# EAGLE design mcu_v06 (EAGLE 6.2)
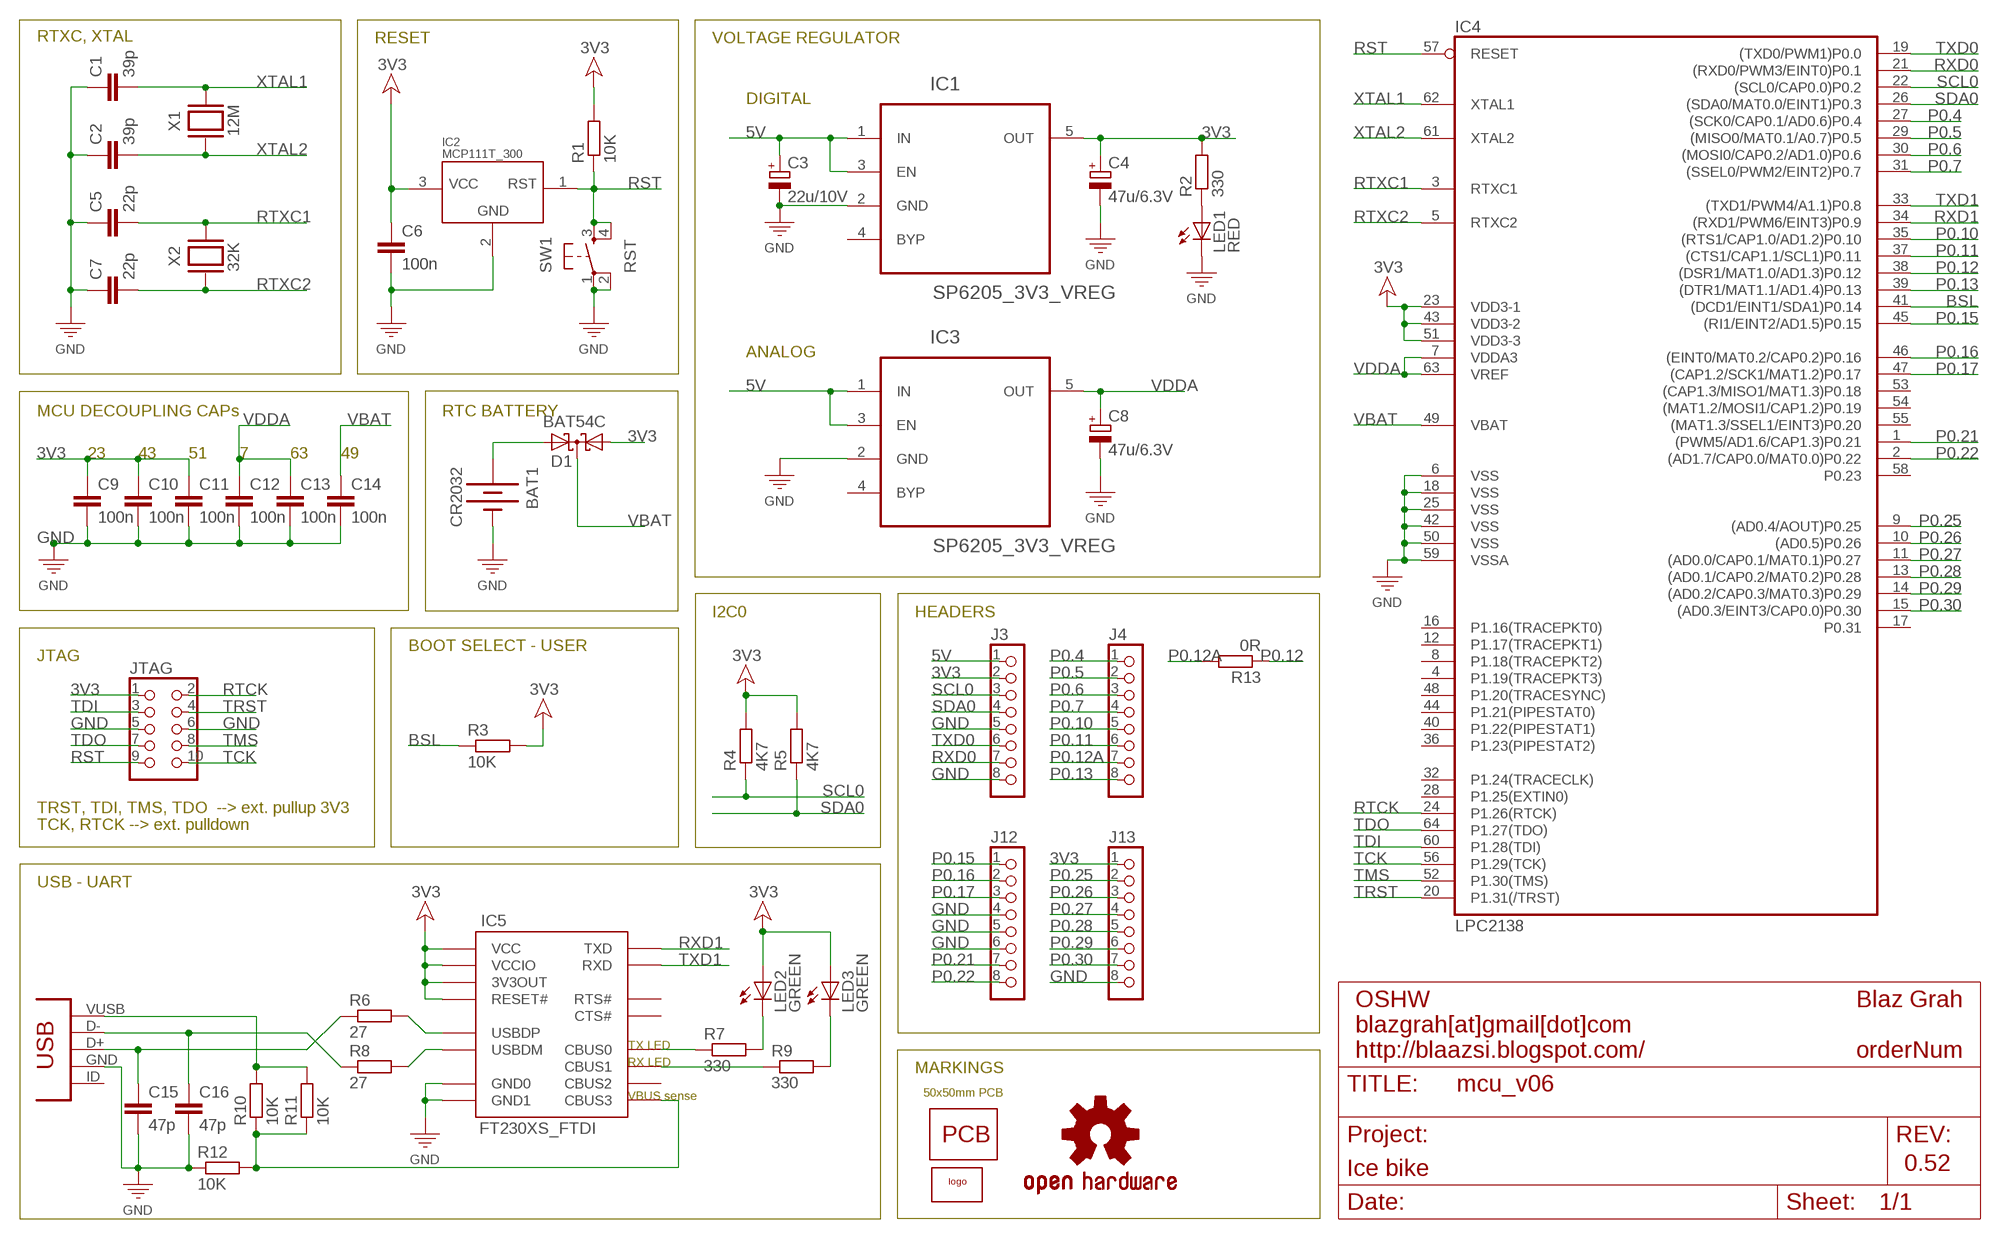
[diagram p0: schematic, sheet 1]

## Parts
BAT1  CR2032  BATTERY20MM  [BATTERY_20MM_SMD]
C1  39p  C-EUC0603  [C0603]
C2  39p  C-EUC0603  [C0603]
C3  22u/10V  CAPACITOR_POL-SMC_B  [SMC_B]
C4  47u/6.3V  CAPACITOR_POL-SMC_B  [SMC_B]
C5  22p  C-EUC0603  [C0603]
C6  100n  C-EUC0603  [C0603]
C7  22p  C-EUC0603  [C0603]
C8  47u/6.3V  CAPACITOR_POL-SMC_B  [SMC_B]
C9  100n  C-EUC0603  [C0603]
C10  100n  C-EUC0603  [C0603]
C11  100n  C-EUC0603  [C0603]
C12  100n  C-EUC0603  [C0603]
C13  100n  C-EUC0603  [C0603]
C14  100n  C-EUC0603  [C0603]
C15  47p  C-EUC0603  [C0603]
C16  47p  C-EUC0603  [C0603]
D1  BAT54C  [SOT23]
DOC  FRAME_DINA4_L  [DP_LOGO]
IC1  SP6205_3V3_VREG  [SOT23-5]
IC2  MCP111T_300  [SOT23]
IC3  SP6205_3V3_VREG  [SOT23-5]
IC4  LPC2138  LCP2138_LQFP64  [LQFP64]
IC5  FT230XS_FTDI  [SSOP16]
J3  CON_HEADER_1X08-PTH  [M1X8]
J4  CON_HEADER_1X08-PTH  [M1X8]
J12  CON_HEADER_1X08-PTH  [M1X8]
J13  CON_HEADER_1X08-PTH  [M1X8]
JTAG  CON_HEADER_2X05-PTH+SHROUDED_A  [PINSHRD_PTH_2X05]
LED1  RED  LED0805  [LED0805]
LED2  GREEN  LED0805  [LED0805]
LED3  GREEN  LED0805  [LED0805]
LOGO1  OSHW-LOGOS  [OSHW-LOGO-S]
PCB1  PCB  [PCB_50X50]
R1  10K  R-EU0603  [R0603]
R2  330  R-EU0603  [R0603]
R3  10K  R-EU0603  [R0603]
R4  4K7  R-EU0603  [R0603]
R5  4K7  R-EU0603  [R0603]
R6  27  R-EU0603  [R0603]
R7  330  R-EU0603  [R0603]
R8  27  R-EU0603  [R0603]
R9  330  R-EU0603  [R0603]
R10  10K  R-EU0603  [R0603]
R11  10K  R-EU0603  [R0603]
R12  10K  R-EU0603  [R0603]
R13  0R  R-EU0603J  [R0603_JUMP]
SW1  RST  TACTIL_BUTTON  [BUTTON_SW_4P_SMD]
U$13  LOGO  [LOGO_SMILE]
USB1  CON-USB-F-MINI-B  [CONN_USB_MINI-B]
X1  12M  CRYSTALSMD_4.8X10.6  [CRYSTAL_12M_4.8X10.6MM]
X2  32K  CRYSTALSMD_32K  [CRYSTAL_32K_SMD]

## Nets
3V3 [power]: C4.+ C6.1 C9.1 C10.1 C11.1 D1.1(A1) IC1.5(OUT) IC2.3(VCC) IC4.23(VDD3-1) IC4.43(VDD3-2) IC4.51(VDD3-3) IC5.P$3(VCCIO) IC5.P$10(3V3OUT) IC5.P$11(RESET#) IC5.P$12(VCC) J3.2 J13.1 JTAG.1 LED2.A LED3.A R1.2 R2.2 R3.2 R4.2 R5.2
5V [supply]: C3.+ IC1.1(IN) IC1.3(EN) IC3.1(IN) IC3.3(EN) J3.1
BSL: IC4.41((DCD1/EINT1/SDA1)P0.14) R3.1
GND [power]: BAT1.NEG C1.1 C2.1 C3.- C4.- C5.1 C6.2 C7.1 C8.- C9.2 C10.2 C11.2 C12.2 C13.2 C14.2 C15.2 C16.2 IC1.2(GND) IC2.2(GND) IC3.2(GND) IC4.6(VSS) IC4.18(VSS) IC4.25(VSS) IC4.42(VSS) IC4.50(VSS) IC4.59(VSSA) IC5.P$5(GND0) IC5.P$13(GND1) J3.5 J3.8 J12.4 J12.5 J12.6 J13.8 JTAG.5 JTAG.6 LED1.C R12.1 SW1.1 SW1.2 USB1.GND
N$4: LED1.A R2.1
N$5: BAT1.POS1(POZ) BAT1.POS2(POZ) D1.2(A2)
N$6: C16.1 R8.1 USB1.D-
N$7: C15.1 R6.1 USB1.D+
N$8: IC5.P$9(USBDM) R8.2
N$9: IC5.P$8(USBDP) R6.2
N$10: R10.2 R11.2 USB1.VUSB
N$11: IC5.P$16(CBUS3) R10.1 R11.1 R12.2
N$12: IC5.P$14(CBUS1) R9.1
N$13: LED2.C R7.2
N$14: LED3.C R9.2
N$15: IC5.P$15(CBUS0) R7.1
P0.4: IC4.27((SCK0/CAP0.1/AD0.6)P0.4) J4.1
P0.5: IC4.29((MISO0/MAT0.1/A0.7)P0.5) J4.2
P0.6: IC4.30((MOSI0/CAP0.2/AD1.0)P0.6) J4.3
P0.7: IC4.31((SSEL0/PWM2/EINT2)P0.7) J4.4
P0.10: IC4.35((RTS1/CAP1.0/AD1.2)P0.10) J4.5
P0.11: IC4.37((CTS1/CAP1.1/SCL1)P0.11) J4.6
P0.12: IC4.38((DSR1/MAT1.0/AD1.3)P0.12) R13.1
P0.12A: J4.7 R13.2
P0.13: IC4.39((DTR1/MAT1.1/AD1.4)P0.13) J4.8
P0.15: IC4.45((RI1/EINT2/AD1.5)P0.15) J12.1
P0.16: IC4.46((EINT0/MAT0.2/CAP0.2)P0.16) J12.2
P0.17: IC4.47((CAP1.2/SCK1/MAT1.2)P0.17) J12.3
P0.21: IC4.1((PWM5/AD1.6/CAP1.3)P0.21) J12.7
P0.22: IC4.2((AD1.7/CAP0.0/MAT0.0)P0.22) J12.8
P0.25: IC4.9((AD0.4/AOUT)P0.25) J13.2
P0.26: IC4.10((AD0.5)P0.26) J13.3
P0.27: IC4.11((AD0.0/CAP0.1/MAT0.1)P0.27) J13.4
P0.28: IC4.13((AD0.1/CAP0.2/MAT0.2)P0.28) J13.5
P0.29: IC4.14((AD0.2/CAP0.3/MAT0.3)P0.29) J13.6
P0.30: IC4.15((AD0.3/EINT3/CAP0.0)P0.30) J13.7
RST: IC2.1(RST) IC4.57(RESET) JTAG.9 R1.1 SW1.3 SW1.4
RTCK: IC4.24(P1.26(RTCK)) JTAG.2
RTXC1: C5.2 IC4.3(RTXC1) X2.X2
RTXC2: C7.2 IC4.5(RTXC2) X2.X1
RXD0: IC4.21((RXD0/PWM3/EINT0)P0.1) J3.7
RXD1: IC4.34((RXD1/PWM6/EINT3)P0.9) IC5.P$1(TXD)
SCL0: IC4.22((SCL0/CAP0.0)P0.2) J3.3 R4.1
SDA0: IC4.26((SDA0/MAT0.0/EINT1)P0.3) J3.4 R5.1
TCK: IC4.56(P1.29(TCK)) JTAG.10
TDI: IC4.60(P1.28(TDI)) JTAG.3
TDO: IC4.64(P1.27(TDO)) JTAG.7
TMS: IC4.52(P1.30(TMS)) JTAG.8
TRST: IC4.20(P1.31(/TRST)) JTAG.4
TXD0: IC4.19((TXD0/PWM1)P0.0) J3.6
TXD1: IC4.33((TXD1/PWM4/A1.1)P0.8) IC5.P$4(RXD)
VBAT: C14.1 D1.3(CC) IC4.49(VBAT)
VDDA [power]: C8.+ C12.1 C13.1 IC3.5(OUT) IC4.7(VDDA3) IC4.63(VREF)
XTAL1: C1.2 IC4.62(XTAL1) X1.P$2
XTAL2: C2.2 IC4.61(XTAL2) X1.P$1
Unconnected: IC1.4(BYP) IC3.4(BYP) IC4.4(P1.19(TRACEPKT3)) IC4.8(P1.18(TRACEPKT2)) IC4.12(P1.17(TRACEPKT1)) IC4.16(P1.16(TRACEPKT0)) IC4.17(P0.31) IC4.28(P1.25(EXTIN0)) IC4.32(P1.24(TRACECLK)) IC4.36(P1.23(PIPESTAT2)) IC4.40(P1.22(PIPESTAT1)) IC4.44(P1.21(PIPESTAT0)) IC4.48(P1.20(TRACESYNC)) IC4.53((CAP1.3/MISO1/MAT1.3)P0.18) IC4.54((MAT1.2/MOSI1/CAP1.2)P0.19) IC4.55((MAT1.3/SSEL1/EINT3)P0.20) IC4.58(P0.23) IC5.P$2(RTS#) IC5.P$6(CTS#) IC5.P$7(CBUS2) USB1.BODY@1(BODY) USB1.BODY@2(BODY) USB1.BODY@3(BODY) USB1.BODY@4(BODY) USB1.ID(USBID)

## Notes on the sheet
- RTXC, XTAL | RESET | VOLTAGE REGULATOR
- DIGITAL
- ANALOG
- MCU DECOUPLING CAPs | RTC BATTERY
- 23 | 43 | 51 | 7 | 63 | 49
- I2C0 | HEADERS
- BOOT SELECT - USER
- JTAG
- TRST, TDI, TMS, TDO  --> ext. pullup 3V3
- TCK, RTCK --> ext. pulldown
- USB - UART
- TX LED
- RX LED
- MARKINGS
- VBUS sense | 50x50mm PCB

## Library data of the parts
BAT1 = 00_beegee:BATTERY: BATTERY CONNECTORS
C1 C2 C5-C7 C9-C16 = 00_beegee:C-EU: CAPACITOR 22p ... 0603..... Farnell <http://si.farnell.com/multicomp/mcca000196/mlcc-0603-np0-50v-22pf/dp/1759057RL> ... 0.60€/100kom (dec. 2011) 100n .. 0603..... Farnell <http://si.farnell.com/multicomp/mcca000255/mlcc-0603-x7r-50v-100nf/dp/1759122> ... 0.60€/100kom (dec. 2011)
C3 C4 C8 = 10_dang_prototyps:CAPACITOR_POL: Polarized capacitor in various packages
D1 = diode:BAT54C: Schottky Diodes Source: Fairchild .. BAT54.pdf
DOC = 10_dang_prototyps:FRAME_DINA4_L: A4 DP frame Standard Dangerous Prototypes schematic frame. Automagically adds the DP logo and standard texts to the PCB Use the atrribute in the schematic editor to change the fields.; AUTHOR: Blaz Grah; DATE: 23.4.2012; LICENSE: OSHW; ORDER_NUM: orderNum; PROJECT: Ice bike; REV: 0.52; URL1: blazgrah[at]gmail[dot]com; URL2: http://blaazsi.blogspot.com/
IC1 IC3 = 01_farnell:SP6205_3V3_VREG; OC_FARNELL: 9388338; PACKAGE: SOT-23-5
IC2 = 00_beegee:MCP111T_300: Voltage supervissor Farnell: http://si.farnell.com/microchip/mcp111t-300e-tt/suppervisor-1ua-2-93v-sot-23b/dp/1605552RL 0,38€/1
IC4 = 00_beegee:LCP2138: NXP - LPC2138FBD64 32bit ARM7, 512k FLASH, LQFP64 ... Farnell <http://si.farnell.com/nxp/lpc2138fbd64/16-32bit-mcu-arm7-512k-flash-64lqfp/dp/1727704> ... 27.18€ (dec.2011)
IC5 = 01_farnell:FT230XS_FTDI: USB to UART http://si.farnell.com/ftdi/ft230xs/i-f-usb2-0-fs-to-basic-uart-16ssop/dp/2081321?Ntt=ft230xs 1.56€/1
J3 J4 J12 J13 = 10_dang_prototyps:CON_HEADER_1X08
JTAG = 10_dang_prototyps:CON_HEADER_2X05: 2x05 pin header
LED1-LED3 = 11_SparkFun:LED: LEDs Standard schematic elements and footprints for 5mm, 3mm, 1206, and 0603 sized LEDs. 5mm - Spark Fun Electronics SKU : COM-00529 (and others)
LOGO1 = 11_SparkFun:OSHW-LOGO: Open Source Hardware Logo This logo indicates the piece of hardware it is found on incorporates a OSHW license and/or adheres to the definition of open source hardware found here: http://freedomdefined.org/OSHW
PCB1 = 00_beegee:PCB: PCB size template
R1-R13 = 00_beegee:R-EU: RESISTOR Resistors: 10k ... 0603 ... Farnell <http://si.farnell.com/panasonic/erj3geyj103v/resistor-0603-10k-5-0-1w/dp/2059627> ... 0.40€/50kom (dec.2011)
SW1 = 00_beegee:TACTIL_BUTTON
U$13 = 00_beegee:LOGO
USB1 = 10_dang_prototyps:CON-USB-F: USB Female connector
X1 X2 = 00_beegee:CRYSTAL: CRYSTAL

## Net classes
0 default: width 0.254 mm, clearance 0.178 mm
1 power: width 0.254 mm, clearance 0.178 mm to class 0, clearance 0.178 mm
2 supply: width 0.381 mm, clearance 0.254 mm to class 0, clearance 0.254 mm to class 1, clearance 0.254 mm

## Board
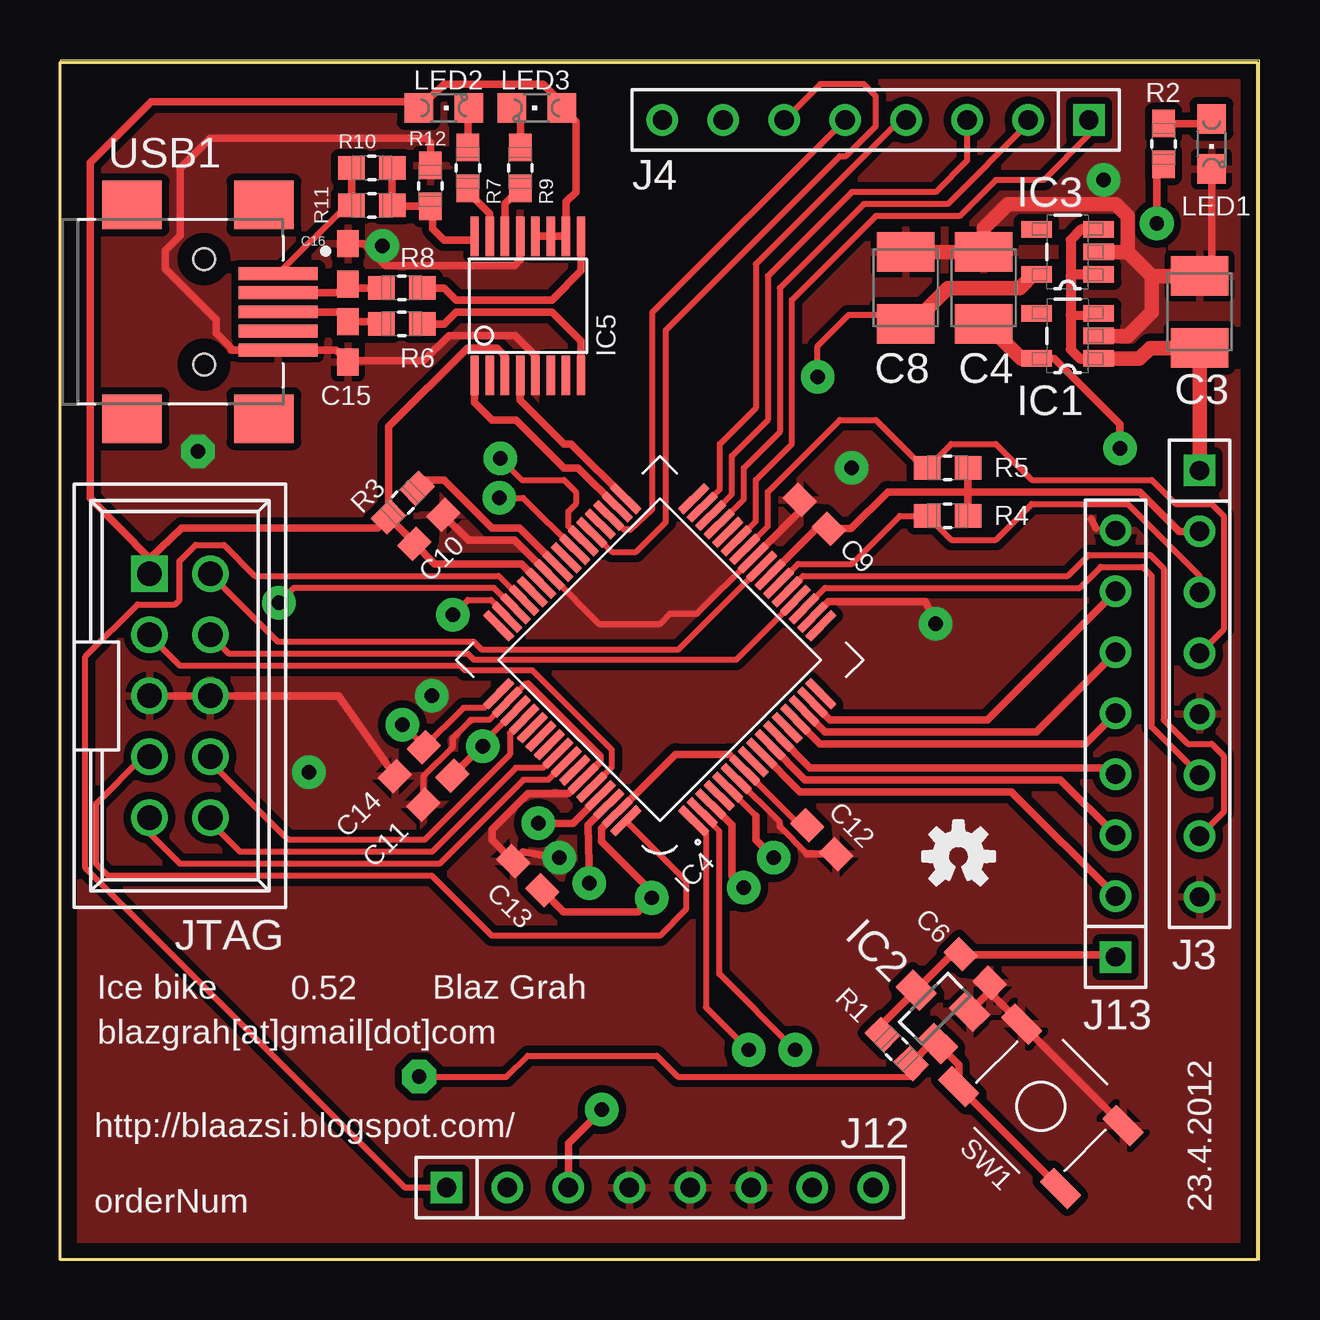
[diagram p1: board, top side]
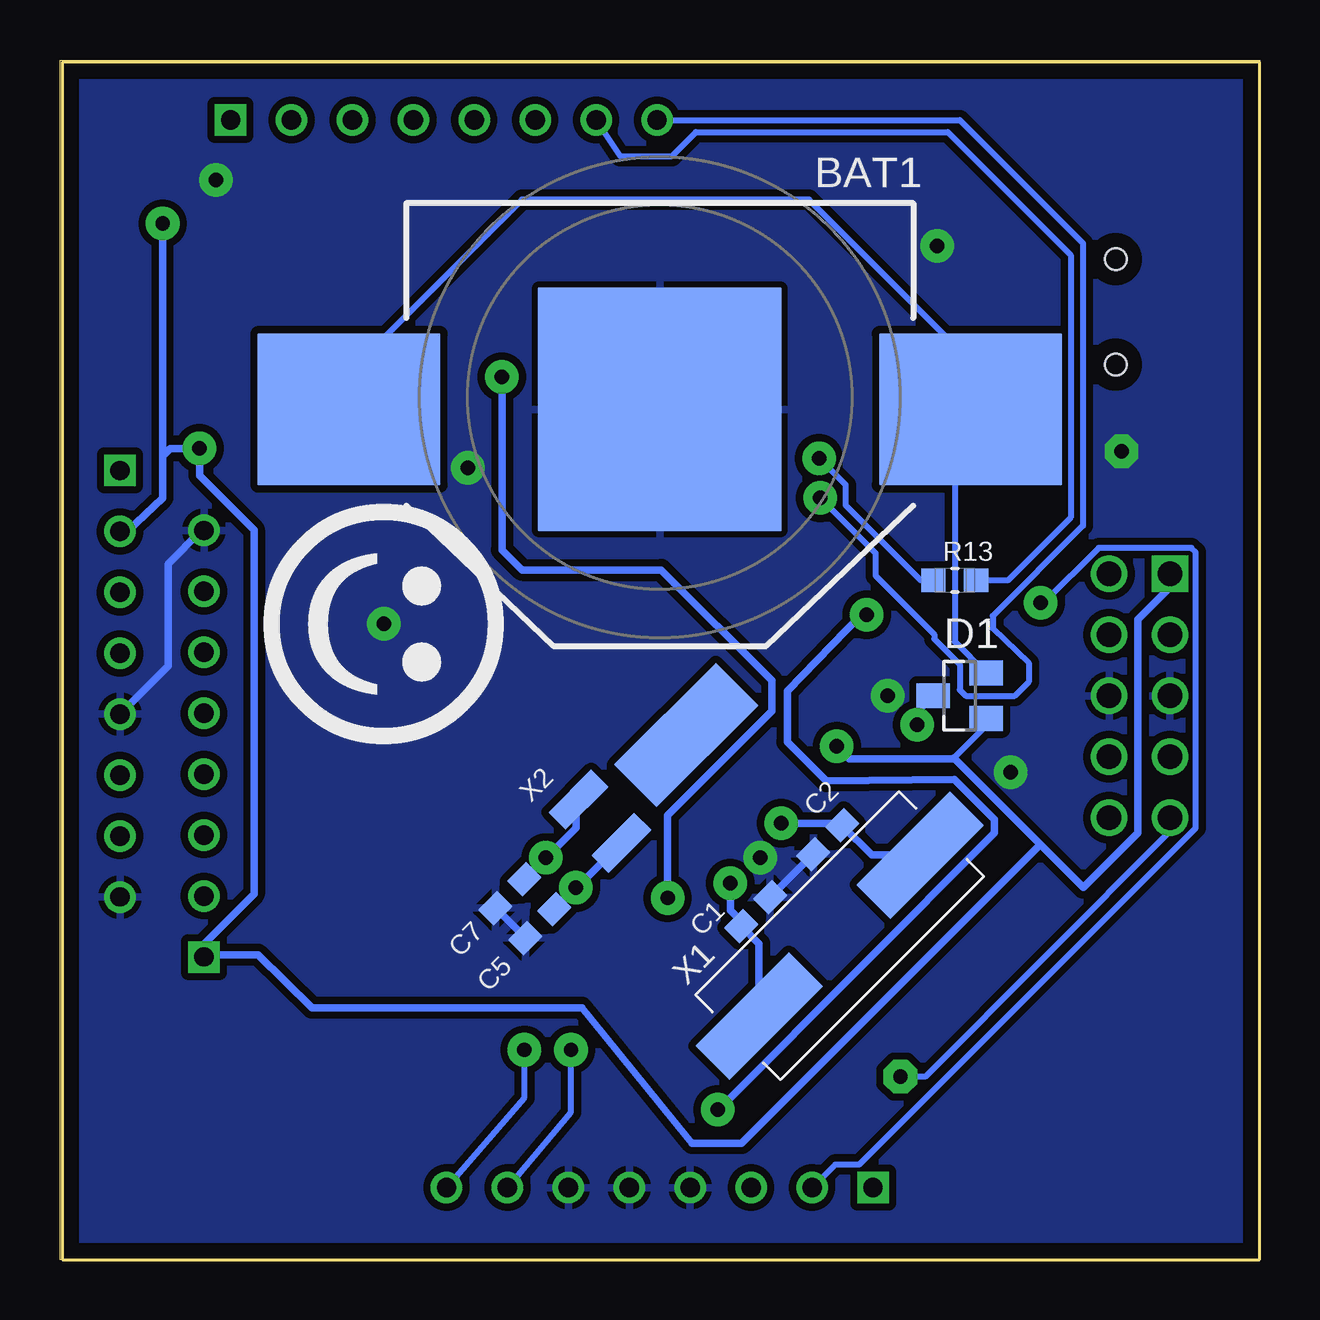
[diagram p2: board, bottom side, seen from below]

Size 50 x 50 mm. Coordinates in mm from the lower left corner, seen from the top.
Outline: 0,0 50,0 50,50 0,50 0,0
Copper layers (1*16): Top 0.035mm / dielectric 1.5mm / Bottom 0.035mm
Design rules: minimum track width 6mil, minimum drill 12mil, track to track 6mil, track to pad 6mil, pad to pad 6mil, via to via 6mil, smd to smd 0mil, copper to edge 25mil, drill to drill 25mil, minimum pad ring 10mil, minimum via ring 6mil, stop-mask expansion 2mil, vias tented up to drill 100mil, thermal gap 10mil

### Footprints (pad centres in the part's own frame; a part is rotated, then mirrored left to right if it is on the bottom)
BATTERY_20MM_SMD = smd 10.16 x 10.16: NEG 0,0 | smd 7.62 x 6.35: POS1 -12.954,0; POS2 12.954,0
C0603 = smd 1.1 x 0.9: 1 -0.85,0; 2 0.85,0
SMC_B = smd 1.6 x 2.4: + -1.5,0; - 1.5,0
SOT23 = smd 1 x 1.4: 1 -0.95,-1.1; 2 0.95,-1.1; 3 0,1.1
SOT23-5 = smd 1.27 x 0.66: 1 -1.295,0.94; 2 -1.295,0; 3 -1.295,-0.94; 4 1.295,-0.94; 5 1.295,0.94
LQFP64 = smd 0.3 x 1.5: 1 -3.75,-5.75; 2 -3.25,-5.75; 3 -2.75,-5.75; 4 -2.25,-5.75; 5 -1.75,-5.75; 6 -1.25,-5.75; 7 -0.75,-5.75; 8 -0.25,-5.75; 9 0.25,-5.75; 10 0.75,-5.75; 11 1.25,-5.75; 12 1.75,-5.75; 13 2.25,-5.75; 14 2.75,-5.75; 15 3.25,-5.75; 16 3.75,-5.75; 33 3.75,5.75; 34 3.25,5.75; 35 2.75,5.75; 36 2.25,5.75; 37 1.75,5.75; 38 1.25,5.75; 39 0.75,5.75; 40 0.25,5.75; 41 -0.25,5.75; 42 -0.75,5.75; 43 -1.25,5.75; 44 -1.75,5.75; 45 -2.25,5.75; 46 -2.75,5.75; 47 -3.25,5.75; 48 -3.75,5.75 | smd 1.5 x 0.3: 17 5.75,-3.75; 18 5.75,-3.25; 19 5.75,-2.75; 20 5.75,-2.25; 21 5.75,-1.75; 22 5.75,-1.25; 23 5.75,-0.75; 24 5.75,-0.25; 25 5.75,0.25; 26 5.75,0.75; 27 5.75,1.25; 28 5.75,1.75; 29 5.75,2.25; 30 5.75,2.75; 31 5.75,3.25; 32 5.75,3.75; 49 -5.75,3.75; 50 -5.75,3.25; 51 -5.75,2.75; 52 -5.75,2.25; 53 -5.75,1.75; 54 -5.75,1.25; 55 -5.75,0.75; 56 -5.75,0.25; 57 -5.75,-0.25; 58 -5.75,-0.75; 59 -5.75,-1.25; 60 -5.75,-1.75; 61 -5.75,-2.25; 62 -5.75,-2.75; 63 -5.75,-3.25; 64 -5.75,-3.75
SSOP16 = smd 0.35 x 1.6: P$1 -2.223,-2.9; P$2 -1.587,-2.9; P$3 -0.953,-2.9; P$4 -0.318,-2.9; P$5 0.318,-2.9; P$6 0.953,-2.9; P$7 1.587,-2.9; P$8 2.223,-2.9; P$9 2.223,2.9; P$10 1.587,2.9; P$11 0.953,2.9; P$12 0.318,2.9; P$13 -0.318,2.9; P$14 -0.953,2.9; P$15 -1.587,2.9; P$16 -2.223,2.9
M1X8 = drill 0.8 square: 1 -8.89,0 | drill 0.8: 2 -6.35,0; 3 -3.81,0; 4 -1.27,0; 5 1.27,0; 6 3.81,0; 7 6.35,0; 8 8.89,0
PINSHRD_PTH_2X05 = drill 1.016 square: 1 -5.08,-1.27 | drill 1.016: 2 -5.08,1.27; 3 -2.54,-1.27; 4 -2.54,1.27; 5 0,-1.27; 6 0,1.27; 7 2.54,-1.27; 8 2.54,1.27; 9 5.08,-1.27; 10 5.08,1.27
LED0805 = smd 1.2 x 1.2: A 0,-1.05; C 0,1.05
R0603 = smd 1.118 x 0.94: 1 -0.85,0; 2 0.85,0
R0603_JUMP = smd 1.016 x 0.94: 1 -0.89,0; 2 0.89,0
BUTTON_SW_4P_SMD = smd 1.6 x 0.8: 1 -3,1.85; 2 3,1.85; 3 -3,-1.85; 4 3,-1.85
CONN_USB_MINI-B = smd 2 x 2.5: BODY@1 -4.45,2.5; BODY@2 4.45,2.5; BODY@3 4.45,-3; BODY@4 -4.45,-3 | smd 0.5 x 3.3: D+ 0,3.1; D- -0.8,3.1; GND 1.6,3.1; ID 0.8,3.1; VUSB -1.6,3.1 | hole 0.9: -2.2,0; 2.2,0
CRYSTAL_12M_4.8X10.6MM = smd 5.5 x 2: P$1 4.75,0; P$2 -4.75,0
CRYSTAL_32K_SMD = smd 2.5 x 6: SHEILD -0.01,5.1 | smd 1 x 2.5: X1 -1.28,0.02; X2 1.26,0.02

### Placement (x,y rotation side)
BAT1  25,35.44 0 bottom
C1  21,14.5 225 bottom
C2  18,17.5 45 bottom
C3  47.5,39.5 90 top
C4  38.5,40.5 90 top
C5  30,14 45 bottom
C6  38.15,12.13 315 top
C7  31.25,15.25 45 bottom
C8  35.25,40.5 90 top
C9  31.44,31.06 135 top
C10  15.38,30.44 45 top
C11  15.75,19.56 225 top
C12  31.75,17.5 315 top
C13  19.5,16 135 top
C14  14.56,20.75 225 top
C15  12,38.25 270 top
C16  12,41.5 90 top
D1  12.5,23.5 90 bottom
DOC  1.63,1.94 0 top
IC1  42,38.5 180 top
IC2  36.47,10.45 45 top
IC3  42,42 180 top
IC4  25,25 45 top
IC5  19.5,39.75 0 top
J3  47.5,24 270 top
J4  34,47.5 180 top
J12  25,3 0 top
J13  44,21.5 90 top
JTAG  5,23.5 270 top
LED1  48,46.5 180 top
LED2  16,48 270 top
LED3  19.88,48 90 top
LOGO1  37.45,16.8 0 top
PCB1  0,0 0 top
R1  34.88,8.78 135 top
R2  46,46.5 270 top
R3  14.29,31.55 225 top
R4  37,31 0 top
R5  37,33 0 top
R6  14.25,39 0 top
R7  17,45.5 90 top
R8  14.25,40.5 0 top
R9  19.19,45.5 90 top
R10  13,45.5 180 top
R11  13,43.94 180 top
R12  15.44,44.75 270 top
R13  12.7,28.31 0 bottom
SW1  40.89,6.39 315 top
U$13  36.5,26.5 90 top
USB1  6,39.5 270 top
X1  17.5,13.5 45 bottom
X2  27.5,18.25 315 bottom

### Tracks (layer width: path | path; a pad name or v marks a point on that pad's centre or on a via)
3V3  (via drill 0.6 pad 1.4)
  Top 0.254: IC4.51 17.62,21.51
  Top 0.305: R1.2 34.28,9.82 IC2.3 37.19,12.73 C6.1 38.1,12.7 44.45,12.7 J13.1 | IC4.23 31.52,30.46 C9.1 32.96,30.46 34.5,32 37.85,32 | IC5.P$12 IC5.P$11 IC5.P$10 21.09,44.09 21.5,44.5 21.5,47.42 LED3.A 20.93,48.2 20.12,49 16,49 15.45,48.45 14.95,48.45 LED2.A 15.24,48.26 3.81,48.26 1.27,45.72 1.27,31.75 3.75,29.21 | v45.72,43.18 45.72,45.72 R2.2 | 3.75,29.21 5.08,30.48 5.1,30.5 13.24,30.5 R3.2 | 3.75,29.21 JTAG.1 | IC5.P$3 18.54,37.68 18.22,38 16.98,38 13.69,34.71 R3.2 | v17.62,21.4 17.57,21.45 | 17.62,21.51 v17.62,21.4 | C11.1 17.59,21.4 v17.62,21.4 | 37.85,32 R4.2 | R5.2 37.85,32 | 37.85,32 45,32 46.65,30.35 J3.2 | IC1.5 41.44,37.56 44.18,34.82 v44.18,33.82 v44.19,33.81 | R3.2 14.77,29.87 C10.1 15.61,29 19.23,29 IC4.43
  Top 0.61: IC1.5 40.06,37.56 38.62,39 C4.+
  Bottom 0.254: D1.1 11.4,22.24 12.74,20.9 12.74,20.89 12.75,20.88
  Bottom 0.305: 45.72,33.5 45.72,31.75 47.18,30.36 J3.2 | 45.72,33.5 v45.72,43.18 | 44.45,12.7 41.91,15.24 41.91,30.41 44.19,32.69 v44.19,33.81 45.41,33.81 45.72,33.5 | 9.14,17.3 7.35,15.51 5.08,17.78 5.08,26.67 3.75,28 JTAG.1 | 44.45,12.7 41.75,12.7 39.5,10.5 28.25,10.5 23.65,4.85 21.59,4.85 9.14,17.3 | 44.45,12.7 J13.1 | 12.75,20.88 17.09,20.88 v17.62,21.4 | 9.14,17.3 12.74,20.9
5V
  Top 0.381: 42.12,39.37 43.18,39.37 IC1.3
  Top 0.406: 43.36,43 IC3.3 42.56,42.94 42.12,42.5 42.12,41 | 42.12,41 42.12,39.37 42.12,37.94 42.5,37.56 IC1.1 | IC3.1 42.19,41.06 42.12,41
  Top 0.61: IC1.1 45,37.56 45.44,38 C3.+ J3.1
BSL
  Top 0.305: R3.1 15.24,32.5 16,32.5 18,30.5 19.15,30.5 IC4.41
GND  (via drill 0.6 pad 1.4)
  Top 0.254: 31.15,16.9 30,18.05 30,18.23 IC4.6 | 28.78,29.14 26.56,26.92 25.42,26.92 25,26.5 22.46,26.5 20.5,28.46 IC4.42 | 19.5,24 19.4,24 IC4.50 17.9,22.5 17.12,22.5 16.38,21.75 16.38,21.38 15.15,20.15 C11.2
  Top 0.305: SW1.2 SW1.1 38.75,11.14 C6.2 38.75,11.18 IC2.2 | C16.2 12.65,42.35 13.56,41.44 18.94,41.44 19.18,41.68 | IC5.P$13 19.18,41.68 | 19.18,41.68 19.19,41.69 | 31.15,16.9 C12.2 | C14.2 11.61,23.5 JTAG.6 JTAG.5 | LED1.C 48,41.5 C3.- | R12.1 15.44,46.56 15.25,46.75 6.25,46.75 5,45.5 5,42.69 4.38,42.06 4.38,41.31 6.5,39.19 6.5,38.62 7.22,37.9 | 7.22,37.9 USB1.GND 11.5,37.9 C15.2 12.14,37.46 15.16,37.46 16.22,38.52 18.96,38.52 19.8,37.68 19.8,36.86 IC5.P$5 | 43.18,30.48 42.99,30.86 | C9.2 30.82,31.66 30.96,31.52 31.02,31.38 IC4.25 28.78,29.14 | 7.16,37.9 7.22,37.9 | IC4.18 32.03,27.44 36.06,27.44 v36.5,26.5 | 19.5,24 22.5,21 22.5,20.73 IC4.59 21.2,19.44 19.5,19.44 18,17.94 18,17.5 C13.2 19.3,17 v20.81,16.75 | C10.2 17,30.02 17,30 18.94,30 IC4.42 | 44.45,30.48 J13.8 44.45,30.48
  Top 0.61: C8.- C4.- 38.5,43 39.5,44 44,44 44.5,43.5 44.5,42 | 45.5,41 44.5,42 | 44.5,42 IC3.2 | C3.- 45.5,41 | 45.5,41 45.5,39.5 44.5,38.5 IC1.2
  Bottom 0.305: J13.8 44.11,30.39 45.5,29 45.5,24.73 J3.5 | C5.1 C7.1 | C2.1 C1.1 | 25.2,35.16 25.38,35.16 BAT1.NEG
  other vias: 5.75,33.69 13.44,42.25 10.38,20.31 43.5,45 33,33 15.5,23.5
  pour Bottom (isolate 0.305): 0,49.81 49.81,49.81 49.81,0 0,0
  pour Top (isolate 0.305): 0,49.81 49.81,49.81 49.81,0 0,0
N$4
  Top 0.305: LED1.A 47.8,47.35 R2.1
N$5
  Bottom 0.254: D1.2 12.7,25.75 12.7,36.89 BAT1.POS2 12.7,38.1 18.78,44.18 30.75,44.18 36.83,38.1 BAT1.POS1
N$6
  Top 0.305: USB1.D- 11.65,40.3 C16.1 12.15,40.5 R8.1
N$7
  Top 0.305: USB1.D+ 11.6,39.5 C15.1 13.3,39.1 R6.1
N$8
  Top 0.305: R8.2 16,40.5 16.5,40 20.5,40 21.72,41.22 IC5.P$9
N$9
  Top 0.305: R6.2 16,39 16.5,39.5 20.5,39.5 21.72,38.28 IC5.P$8
N$10
  Top 0.254: R11.2 11.94,43.94 USB1.VUSB
  Top 0.305: R11.2 R10.2
N$11
  Top 0.305: R10.1 R11.1 13.89,43.9 R12.2 15.54,44 15.54,42.96 16,42.5 17.13,42.5 IC5.P$16
N$12
  Top 0.305: IC5.P$14 18.55,44.01 R9.1
N$13
  Top 0.305: R7.2 17,47.95 LED2.C
N$14
  Top 0.254: 19.05,48.26 LED3.C
  Top 0.305: R9.2 19.19,47.64 LED3.C
N$15
  Top 0.305: IC5.P$15 17.91,43.59 17,44.5 R7.1
P0.4
  Top 0.254: J4.1 42.89,46.89 41,45 39,45 37.5,43.5 34,43.5 30.5,40 30.5,34 29,32.5 29,30.77 IC4.27
P0.5
  Top 0.254: J4.2 40.35,47.35 37,44 33.5,44 30,40.5 30,34.5 28.5,33 28.5,31.68 IC4.29
P0.6
  Top 0.254: J4.3 37.81,45.81 36.5,44.5 33,44.5 29.5,41 29.5,35 28,33.5 28,31.89 IC4.30
P0.7
  Top 0.254: J4.4 35,47.5 29,41.5 29,35.5 27.5,34 27.5,32.1 IC4.31
P0.10
  Top 0.254: IC4.35 22.94,31 23.52,30.42 23.78,30.42 24.68,31.26 24.68,39.47 J4.5
P0.11
  Top 0.254: IC4.37 22.22,30.3 23.02,29.5 24,29.5 25.25,30.75 25.25,38.75 32.5,46 32.75,46 34,47.25 34,48.5 33.5,49 31.69,49 J4.6
P0.12  (via drill 0.6 pad 1.4)
  Top 0.254: IC4.38 21.8,29.96 21.19,30.57 21.19,31.19 21.5,31.5 21.5,32 21,32.5 19.26,32.5 v18.36,33.4
  Bottom 0.254: R13.1 14.12,28.31 17.25,31.44 17.25,32.29 v18.36,33.4
P0.12A
  Bottom 0.254: J4.7 26.65,46 24.5,46 23.5,47 13,47 7.88,41.88 7.88,30.94 10.5,28.31 R13.2
P0.13  (via drill 0.6 pad 1.4)
  Top 0.254: 21.48,29.58 IC4.39 19.31,31.75 v18.31,31.75
  Bottom 0.254: J4.8 12.5,47.5 7.36,42.35 7.36,30.59 11.12,26.83 11.12,26.31 9.62,24.88 9.62,24.08 10.2,23.5 12.25,23.5 12.5,23.75 12.5,24.81 13.55,25.87 13.55,26.05 16,28.5 16,29.44 v18.31,31.75
P0.15
  Top 0.254: J12.1 14.38,3 1.06,16.32 1.06,25.13 3.24,27.31 4.8,27.31 4.99,27.49 4.99,29.12 5.65,29.79 6.83,29.79 8.12,28.5 18.28,28.5 19.3,27.48 IC4.45
P0.16  (via drill 0.6 pad 1.4)
  Top 0.254: IC4.46 18.98,27.14 18.94,27.14 18.07,28 9.75,28 v9.12,27.38
  Bottom 0.254: J12.2 17.68,3.96 16.68,3.96 2.66,17.98 2.66,29.48 2.84,29.66 6.7,29.66 8.98,27.38 v9.12,27.38
P0.17  (via drill 0.6 pad 1.4)
  Top 0.254: IC4.47 18.7,26.76 17.96,27.5 17,27.5 v16.38,26.88
  Top 0.305: J12.3 21.19,4.85 v22.59,6.25
  Bottom 0.305: v16.38,26.88 16.62,26.88 19.68,23.7 19.68,21.58 18.05,19.95 12.72,20.01 11.05,18.34 11.05,17.79 22.19,6.62 22.56,6.25 v22.59,6.25
P0.21  (via drill 0.6 pad 1.4)
  Top 0.254: v28.7,8.74 26.92,10.52 26.92,17.78 IC4.1
  Bottom 0.254: v28.7,8.74 28.7,6.14 J12.7
P0.22  (via drill 0.6 pad 1.4)
  Top 0.254: v30.64,8.74 27.48,11.9 27.48,17.86 26.78,18.56 26.78,18.62 IC4.2
  Bottom 0.254: v30.64,8.74 30.64,6.74 J12.8
P0.25
  Top 0.305: IC4.9 30.85,19.5 39.65,19.5 J13.2
P0.26
  Top 0.305: IC4.10 31.06,20 41.69,20 J13.3
P0.27
  Top 0.305: IC4.11 31.27,20.5 43.73,20.5 J13.4
P0.28
  Top 0.305: IC4.13 31.68,21.5 42.73,21.5 J13.5
P0.29
  Top 0.305: IC4.14 31.89,22 40.69,22 J13.6
P0.30
  Top 0.305: IC4.15 32.1,22.5 38.65,22.5 J13.7
RST  (via drill 0.6 pad 1.4)
  Top 0.254: IC4.57 20.35,20 19.31,20 15.81,16.5 5,16.5 3.73,17.77 JTAG.9 | v14.97,7.62 18.62,7.62 19.5,8.5 24.88,8.5 25.75,7.62 35.56,7.62 R1.1
  Top 0.305: SW1.4 SW1.3 37.46,8.12 IC2.1 36.31,9.01 R1.1
  Bottom 0.254: v14.97,7.62 13.94,7.62 3.81,17.78 JTAG.9
RTCK
  Top 0.254: IC4.24 25.79,25.44 17.56,25.44 17.25,25.75 9.1,25.75 JTAG.2
RTXC1  (via drill 0.6 pad 1.4)
  Top 0.305: IC4.3 28,18.11 28,16 v28.5,15.5
  Bottom 0.305: C5.2 v28.5,15.5 28.47,15.5 X2.X2
RTXC2  (via drill 0.6 pad 1.4)
  Top 0.254: IC4.5 27.83,19.67 29,18.5
  Top 0.305: 29,18.5 29,17.5 v29.75,16.75
  Bottom 0.305: C7.2 v29.75,16.75 28.5,18 28.5,19.06 X2.X1
RXD0
  Top 0.254: IC4.21 30.98,28.5 42,28.5 42.88,29.38 45.44,29.38 46,28.81 46,22.5 47,21.5 48,21.5 48.5,21 48.5,18.65 J3.7
RXD1
  Top 0.305: IC5.P$1 17.28,35.72 18,35 19,35 21,33 21.6,33 IC4.34
SCL0
  Top 0.254: IC4.22 30.77,29 33,29 35,31 R4.1 37.15,30 39,30 40.5,31.5 44.5,31.5 47.5,28.5 J3.3
SDA0
  Top 0.254: IC4.26 29.5,30.56 29.5,32 32.5,35 34,35 36,33 R5.1 37.15,34 39,34 40.5,32.5 45.5,32.5 46.5,31.5 48,31.5 48.5,31 48.5,26.27 J3.4
TCK
  Top 0.254: IC4.56 20.15,20.5 19,20.5 15.5,17 7.5,17 6.27,18.23 JTAG.10
TDI
  Top 0.254: IC4.60 23,20.52 23,21.25 19.69,24.56 16.88,24.56 16.69,24.75 5,24.75 3.73,26.02 JTAG.3
TDO
  Top 0.254: JTAG.7 3.46,20.96 1.5,19 1.5,16.5 2,16 15.5,16 18,13.5 25,13.5 26.09,14.59 26.09,15.78 IC4.64
TMS
  Top 0.254: IC4.52 18.75,21.93 18.75,21.06 15.19,17.5 9.5,17.5 6.27,20.73 JTAG.8
TRST
  Top 0.254: IC4.20 28.18,25 17.25,25 17,25.25 7.06,25.25 JTAG.4
TXD0
  Top 0.254: IC4.19 31.89,28 42.5,28 43.38,28.88 45.12,28.88 45.5,28.5 45.5,22.19 J3.6
TXD1
  Top 0.305: IC5.P$4 19.18,35.82 21,34 21.3,34 IC4.33
VBAT  (via drill 0.6 pad 1.4)
  Top 0.254: IC4.49 17.7,23 16.81,23 C14.1 15.16,21.4 v14.27,22.29
  Bottom 0.305: D1.3 14.27,22.83 v14.27,22.29
VDDA  (via drill 0.6 pad 1.4)
  Top 0.254: 30.84,18.1 IC4.7 28.44,20.52 27.9,21.06 | v31.58,36.79 31.58,38.08 32.87,39.37 34.29,39.37
  Top 0.305: 30.84,18.1 C12.1 | 34.29,39.37 C8.+ | 27.9,21.06 25.66,21.06 23.34,18.74 | 23.34,18.74 IC4.63 | C13.1 21,14.5 24.1,14.5 v24.67,15.07 24.67,15.33 22.56,17.44 22.56,17.96 23.34,18.74
  Top 0.61: IC3.5 40.56,41.06 40,40.5 37,40.5 35.5,39 C8.+
  Bottom 0.305: v24.67,15.07 24.67,18.51 20.32,22.86 20.32,24.13 24.94,28.75 30.75,28.75 31.58,29.58 v31.58,36.79
XTAL1  (via drill 0.6 pad 1.4)
  Top 0.305: v22.06,15.69 22,18.11 IC4.62
  Bottom 0.254: 21.5,14 21.59,13.97 C1.2
  Bottom 0.305: 20.38,10.62 X1.P$2 20.86,13.16 C1.2 | v22.06,15.69 22.06,14.56 21.5,14
XTAL2  (via drill 0.6 pad 1.4)
  Top 0.305: v19.94,18.19 21.38,18.19 22.56,19.38 IC4.61
  Bottom 0.305: X1.P$1 16.16,16.86 C2.2 17.5,18 17.69,18.19 v19.94,18.19

### Text on the board
tNames: 23.4.2012